# EAGLE design base-v2 (EAGLE 7.2.0)

## Sheet 1 of 2
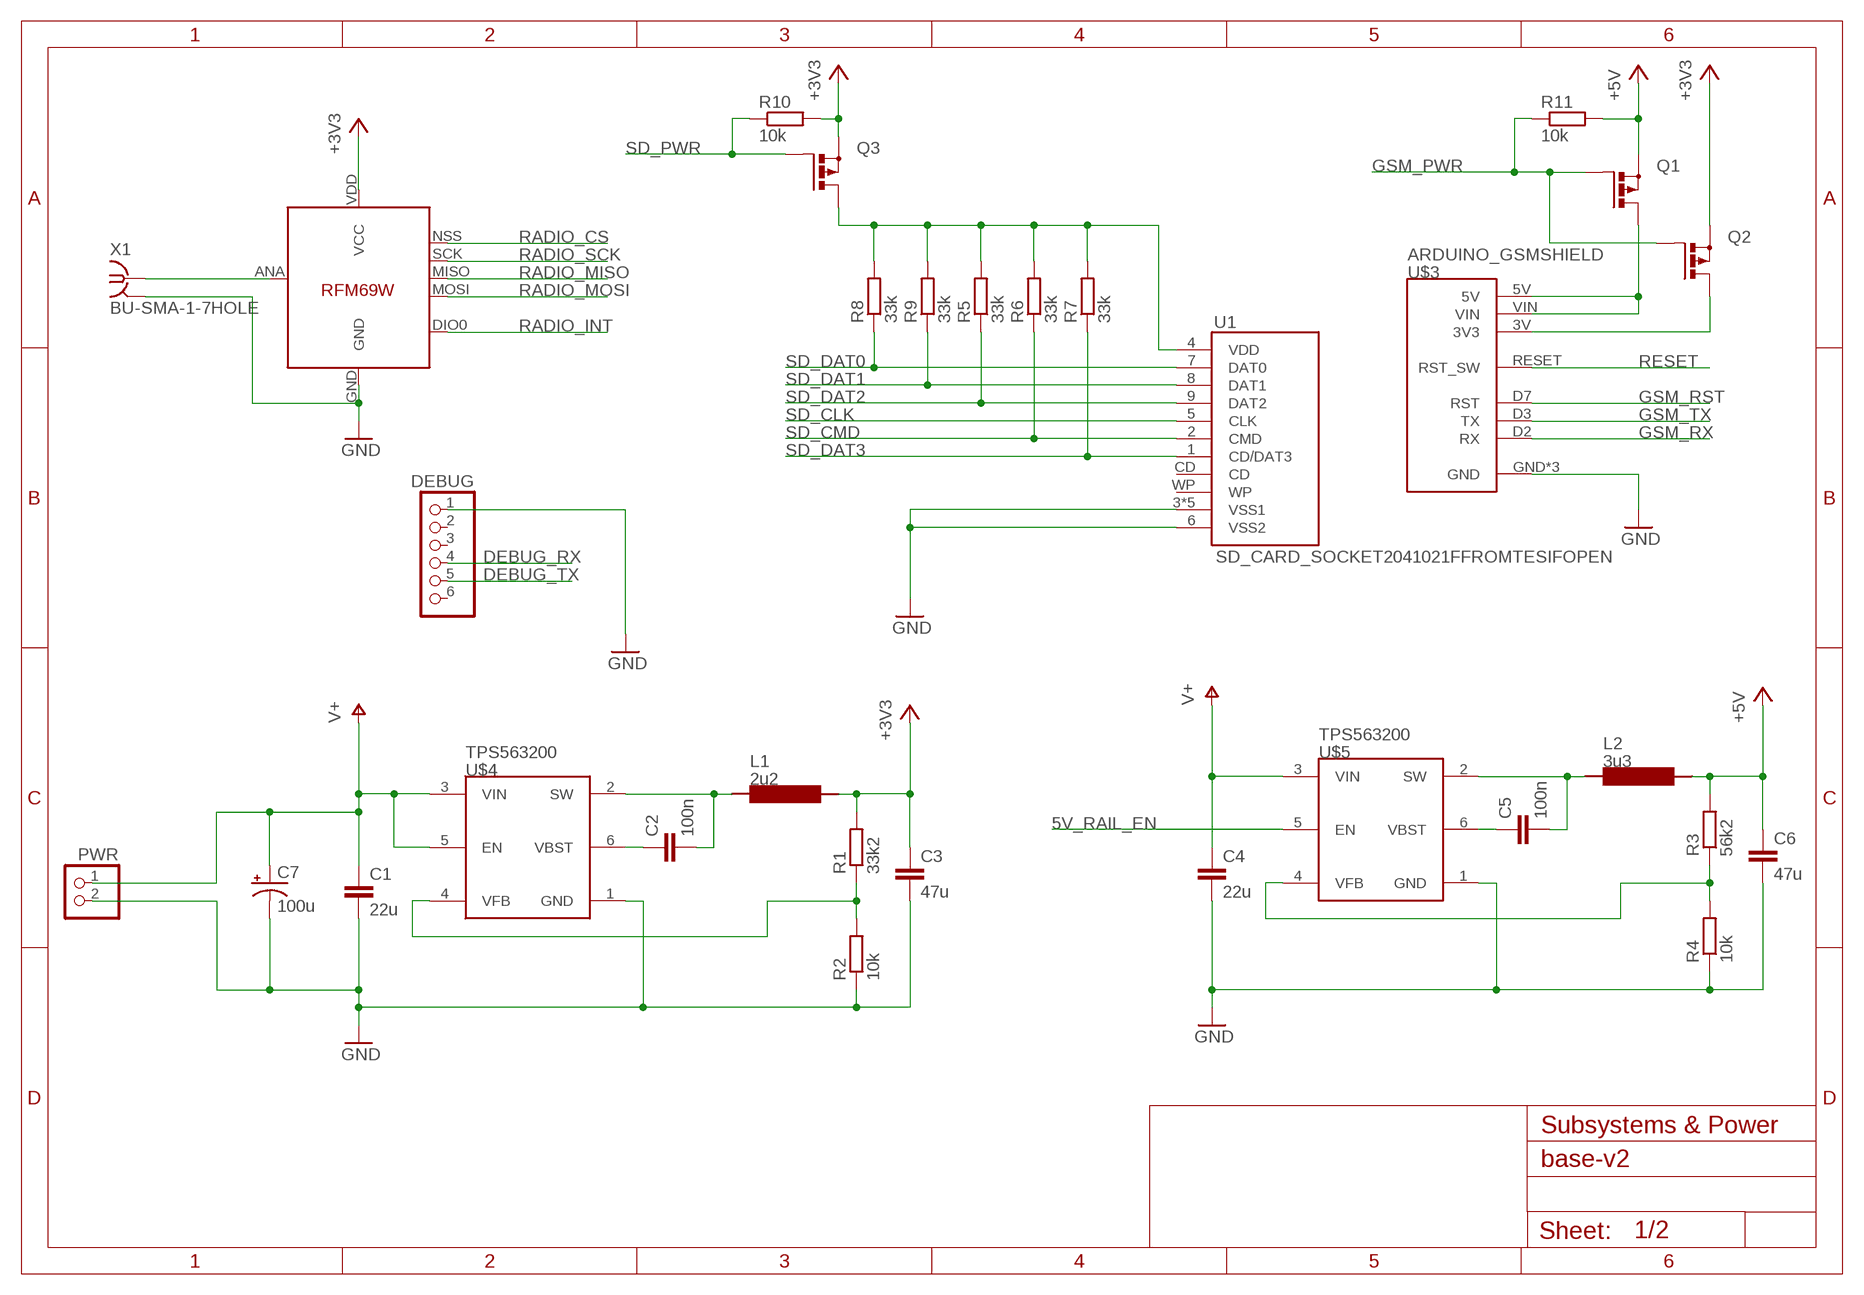
[diagram p0: schematic, sheet 1]

### Parts
C1  22u  CAP1206  [1206]
C2  100n  CAPPTH  [CAP-PTH-SMALL]
C3  47u  CAP1206  [1206]
C4  22u  CAP1206  [1206]
C5  100n  CAPPTH  [CAP-PTH-SMALL]
C6  47u  CAP1206  [1206]
C7  100u  CAP_POLPTH2  [CPOL-RADIAL-10UF-25V]
DEBUG  PINHD-1X6  [1X06]
L1  2u2  SRR7032  [SRR7032]
L2  3u3  SRR7032  [SRR7032]
PWR  PINHD-1X2  [1X02]
Q1  PMOSFET_PTO220BH  [TO220BH]
Q2  PMOSFET_PTO220BH  [TO220BH]
Q3  PMOSFET_PTO220BH  [TO220BH]
R1  33k2  R-EU_0204/7  [0204/7]
R2  10k  R-EU_0204/7  [0204/7]
R3  56k2  R-EU_0204/7  [0204/7]
R4  10k  R-EU_0204/7  [0204/7]
R5  33k  R-EU_0204/7  [0204/7]
R6  33k  R-EU_0204/7  [0204/7]
R7  33k  R-EU_0204/7  [0204/7]
R8  33k  R-EU_0204/7  [0204/7]
R9  33k  R-EU_0204/7  [0204/7]
R10  10k  R-EU_0204/7  [0204/7]
R11  10k  R-EU_0204/7  [0204/7]
U1  SD_CARD_SOCKET2041021FFROMTESIFOPEN  [SDCARD_2041021-3]
U$2  RFM69  [RFM69W-MINPADS]
U$3  ARDUINO_GSMSHIELD  [ARDUINO-NOHOLE]
U$4  TPS563200  [DDC0006A]
U$5  TPS563200  [DDC0006A]
X1  BU-SMA-1-7HOLE  [SMA_1-7HOLES]

### Nets
5V_RAIL_EN: U$5.5(EN) ; also sheet 2
+3V3: C3.1 L1.2 Q2.S Q3.S R1.2 R10.2 U$2.VDD(VCC) ; also sheet 2
+5V: C6.1 L2.2 Q1.S R3.2 R11.2 ; also sheet 2
DEBUG_RX: DEBUG.4 ; also sheet 2
DEBUG_TX: DEBUG.5 ; also sheet 2
GND: C1.2 C3.2 C4.2 C6.2 C7.2(-) DEBUG.1 PWR.2 R2.1 R4.1 U1.3(VSS1) U1.6(VSS2) U1.SH1(VSS1) U1.SH2(VSS1) U1.SH3(VSS1) U1.SH4(VSS1) U$2.GND U$3.GND U$3.GND1(GND) U$3.GND2(GND) U$4.1(GND) U$5.1(GND) X1.2 X1.3 X1.4 X1.5 ; also sheet 2
GSM_PWR: Q1.G Q2.G R11.1 ; also sheet 2
GSM_RST: U$3.D7(RST) ; also sheet 2
GSM_RX: U$3.D2(RX) ; also sheet 2
GSM_TX: U$3.D3(TX) ; also sheet 2
N$1: Q1.D U$3.5V U$3.VIN
N$2: Q2.D U$3.3V(3V3)
RADIO_ANT: U$2.ANA(ANT) X1.1
RADIO_CS: U$2.NSS(SEL) ; also sheet 2
RADIO_INT: U$2.DIO0 ; also sheet 2
RADIO_MISO: U$2.MISO ; also sheet 2
RADIO_MOSI: U$2.MOSI ; also sheet 2
RADIO_SCK: U$2.SCK ; also sheet 2
RESET: U$3.RESET(RST_SW) ; also sheet 2
SD_CLK: U1.5(CLK) ; also sheet 2
SD_CMD: R6.1 U1.2(CMD) ; also sheet 2
SD_DAT0: R8.1 U1.7(DAT0) ; also sheet 2
SD_DAT1: R9.1 U1.8(DAT1) ; also sheet 2
SD_DAT2: R5.1 U1.9(DAT2) ; also sheet 2
SD_DAT3: R7.1 U1.1(CD/DAT3) ; also sheet 2
SD_PWR: Q3.G R10.1 ; also sheet 2
SD_VCC: Q3.D R5.2 R6.2 R7.2 R8.2 R9.2 U1.4(VDD)
V+: C1.1 C4.1 C7.1(+) PWR.1 U$4.3(VIN) U$4.5(EN) U$5.3(VIN)
VREG_3_SW: C2.2 L1.1 U$4.2(SW)
VREG_3_VBST: C2.1 U$4.6(VBST)
VREG_3_VFB: R1.1 R2.2 U$4.4(VFB)
VREG_5_SW: C5.2 L2.1 U$5.2(SW)
VREG_5_VBST: C5.1 U$5.6(VBST)
VREG_5_VFB: R3.1 R4.2 U$5.4(VFB)
Unconnected: DEBUG.2 DEBUG.3 DEBUG.6 U1.CD U1.WP

### Notes on the sheet
- Subsystems & Power

## Sheet 2 of 2
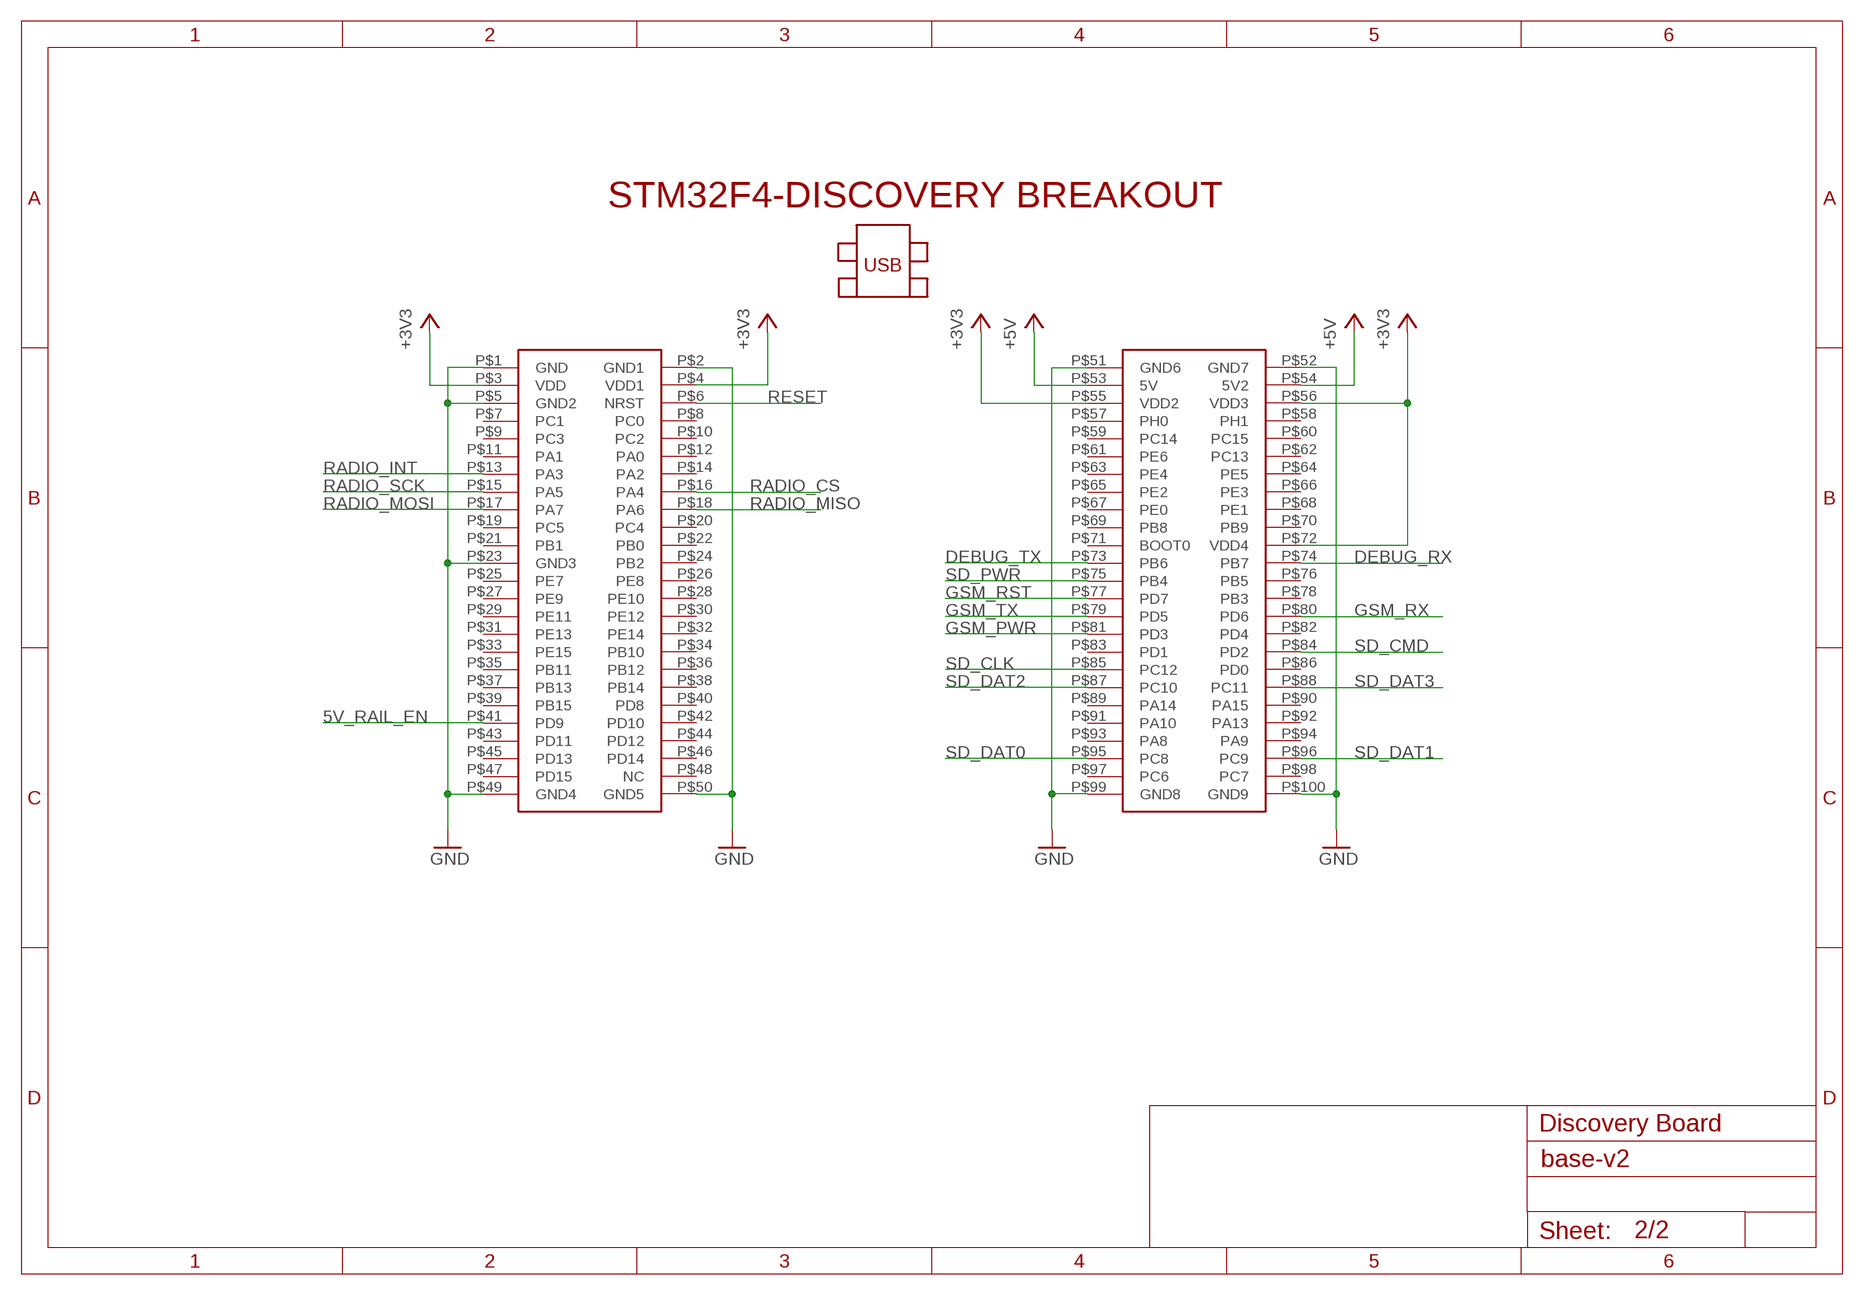
[diagram p1: schematic, sheet 2]

### Parts
U$1  STM32F4-DISCOVERY  [STM32F4-DISCOVERY]

### Nets
5V_RAIL_EN: U$1.P$41(PD9) ; also sheet 1
+3V3: U$1.P$3(VDD) U$1.P$4(VDD1) U$1.P$55(VDD2) U$1.P$56(VDD3) U$1.P$72(VDD4) ; also sheet 1
+5V: U$1.P$53(5V) U$1.P$54(5V2) ; also sheet 1
DEBUG_RX: U$1.P$74(PB7) ; also sheet 1
DEBUG_TX: U$1.P$73(PB6) ; also sheet 1
GND: U$1.P$1(GND) U$1.P$2(GND1) U$1.P$5(GND2) U$1.P$23(GND3) U$1.P$49(GND4) U$1.P$50(GND5) U$1.P$51(GND6) U$1.P$52(GND7) U$1.P$99(GND8) U$1.P$100(GND9) ; also sheet 1
GSM_PWR: U$1.P$81(PD3) ; also sheet 1
GSM_RST: U$1.P$77(PD7) ; also sheet 1
GSM_RX: U$1.P$80(PD6) ; also sheet 1
GSM_TX: U$1.P$79(PD5) ; also sheet 1
RADIO_CS: U$1.P$16(PA4) ; also sheet 1
RADIO_INT: U$1.P$13(PA3) ; also sheet 1
RADIO_MISO: U$1.P$18(PA6) ; also sheet 1
RADIO_MOSI: U$1.P$17(PA7) ; also sheet 1
RADIO_SCK: U$1.P$15(PA5) ; also sheet 1
RESET: U$1.P$6(NRST) ; also sheet 1
SD_CLK: U$1.P$85(PC12) ; also sheet 1
SD_CMD: U$1.P$84(PD2) ; also sheet 1
SD_DAT0: U$1.P$95(PC8) ; also sheet 1
SD_DAT1: U$1.P$96(PC9) ; also sheet 1
SD_DAT2: U$1.P$87(PC10) ; also sheet 1
SD_DAT3: U$1.P$88(PC11) ; also sheet 1
SD_PWR: U$1.P$75(PB4) ; also sheet 1
Unconnected: U$1.P$7(PC1) U$1.P$8(PC0) U$1.P$9(PC3) U$1.P$10(PC2) U$1.P$11(PA1) U$1.P$12(PA0) U$1.P$14(PA2) U$1.P$19(PC5) U$1.P$20(PC4) U$1.P$21(PB1) U$1.P$22(PB0) U$1.P$24(PB2) U$1.P$25(PE7) U$1.P$26(PE8) U$1.P$27(PE9) U$1.P$28(PE10) U$1.P$29(PE11) U$1.P$30(PE12) U$1.P$31(PE13) U$1.P$32(PE14) U$1.P$33(PE15) U$1.P$34(PB10) U$1.P$35(PB11) U$1.P$36(PB12) U$1.P$37(PB13) U$1.P$38(PB14) U$1.P$39(PB15) U$1.P$40(PD8) U$1.P$42(PD10) U$1.P$43(PD11) U$1.P$44(PD12) U$1.P$45(PD13) U$1.P$46(PD14) U$1.P$47(PD15) U$1.P$48(NC) U$1.P$57(PH0) U$1.P$58(PH1) U$1.P$59(PC14) U$1.P$60(PC15) U$1.P$61(PE6) U$1.P$62(PC13) U$1.P$63(PE4) U$1.P$64(PE5) U$1.P$65(PE2) U$1.P$66(PE3) U$1.P$67(PE0) U$1.P$68(PE1) U$1.P$69(PB8) U$1.P$70(PB9) U$1.P$71(BOOT0) U$1.P$76(PB5) U$1.P$78(PB3) U$1.P$82(PD4) U$1.P$83(PD1) U$1.P$86(PD0) U$1.P$89(PA14) U$1.P$90(PA15) U$1.P$91(PA10) U$1.P$92(PA13) U$1.P$93(PA8) U$1.P$94(PA9) U$1.P$97(PC6) U$1.P$98(PC7)

### Notes on the sheet
- Discovery Board

## Library data of the parts
C1-C6 = SparkFun-Capacitors:CAP: Capacitor Standard 0603 ceramic capacitor, and 0.1" leaded capacitor.
C7 = SparkFun-Passives:CAP_POL: Capacitor Polarized These are standard SMD and PTH capacitors. Normally 10uF, 47uF, and 100uF in electrolytic and tantalum varieties. Always verify the external diameter of the through hole cap, it varies with capacity, voltage, and manufacturer. The EIA devices should be standard.
DEBUG = pinhead:PINHD-1X6: PIN HEADER
L1 L2 = FullyCustom:SRR7032
PWR = pinhead:PINHD-1X2: PIN HEADER
Q1-Q3 = transistor-power:PMOSFET_P: Power MOSFET P-Channel
R1-R11 = resistor:R-EU_: RESISTOR, European symbol
U1 = FullyCustom:SD_CARD_SOCKET: SD Memory Card Connector, push-push normal type, CD enable, WP enable
U$1 = STM32F4-DISCOVERY:STM32F4-DISCOVERY
U$2 = Moteino:RFM69
U$3 = FullyCustom:ARDUINO_GSMSHIELD
U$4 U$5 = FullyCustom:TPS563200
X1 = FullyCustom:BU-SMA-1-7HOLE: FEMALE SMA CONNECTOR Radiall distributor RS 112-3794; OC_FARNELL: unknown; OC_NEWARK: unknown

## Board
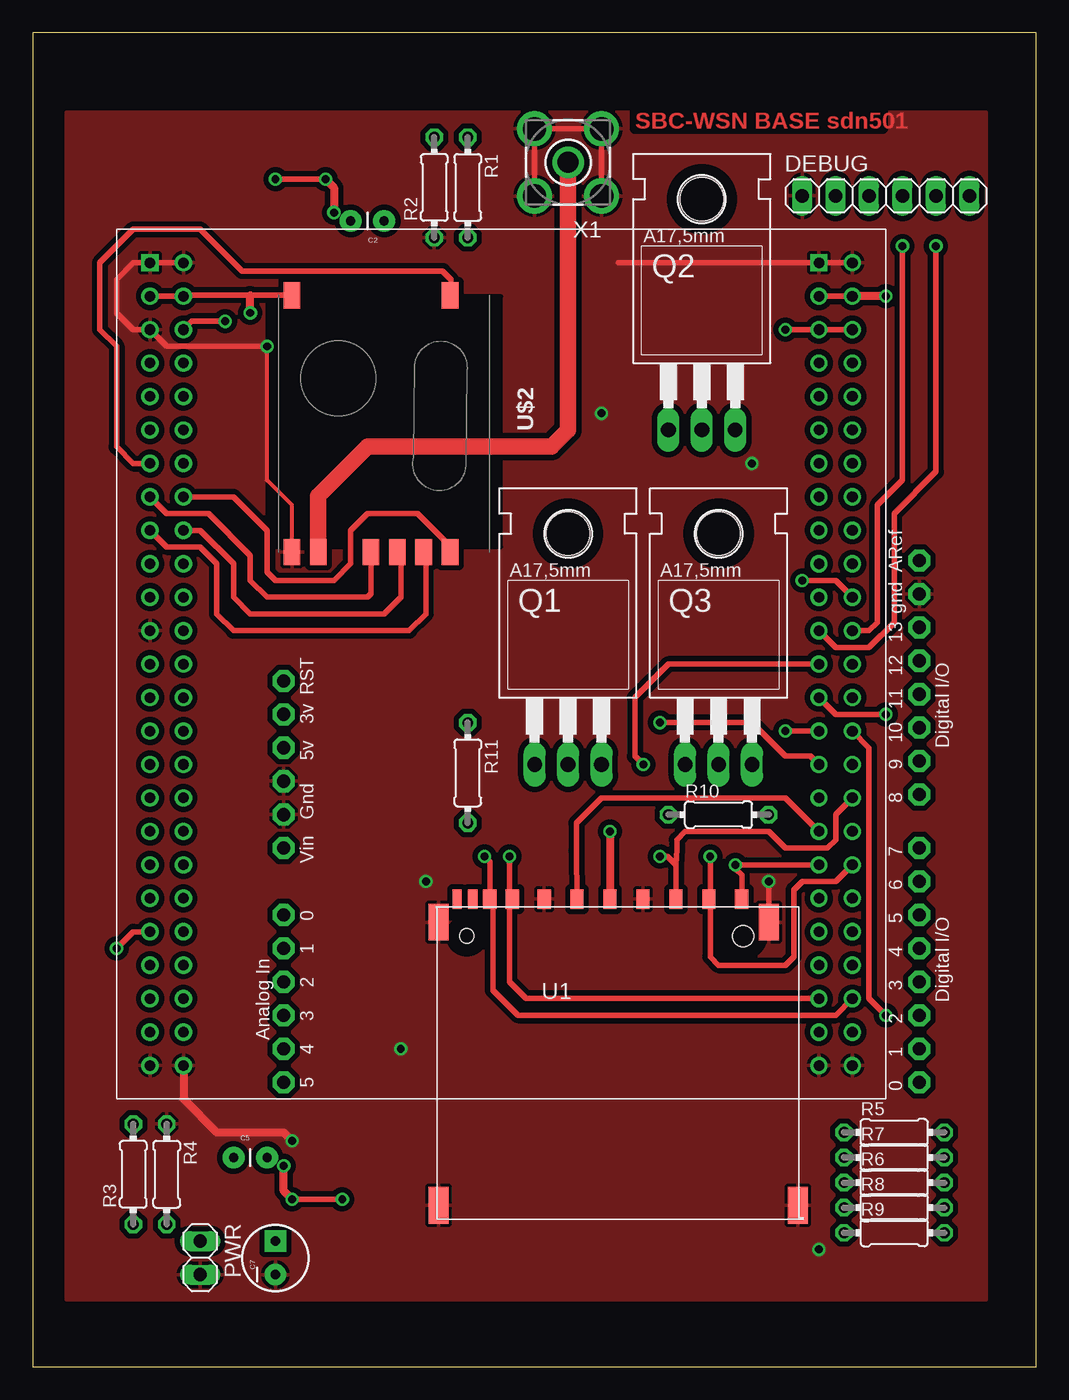
[diagram p2: board, top side]
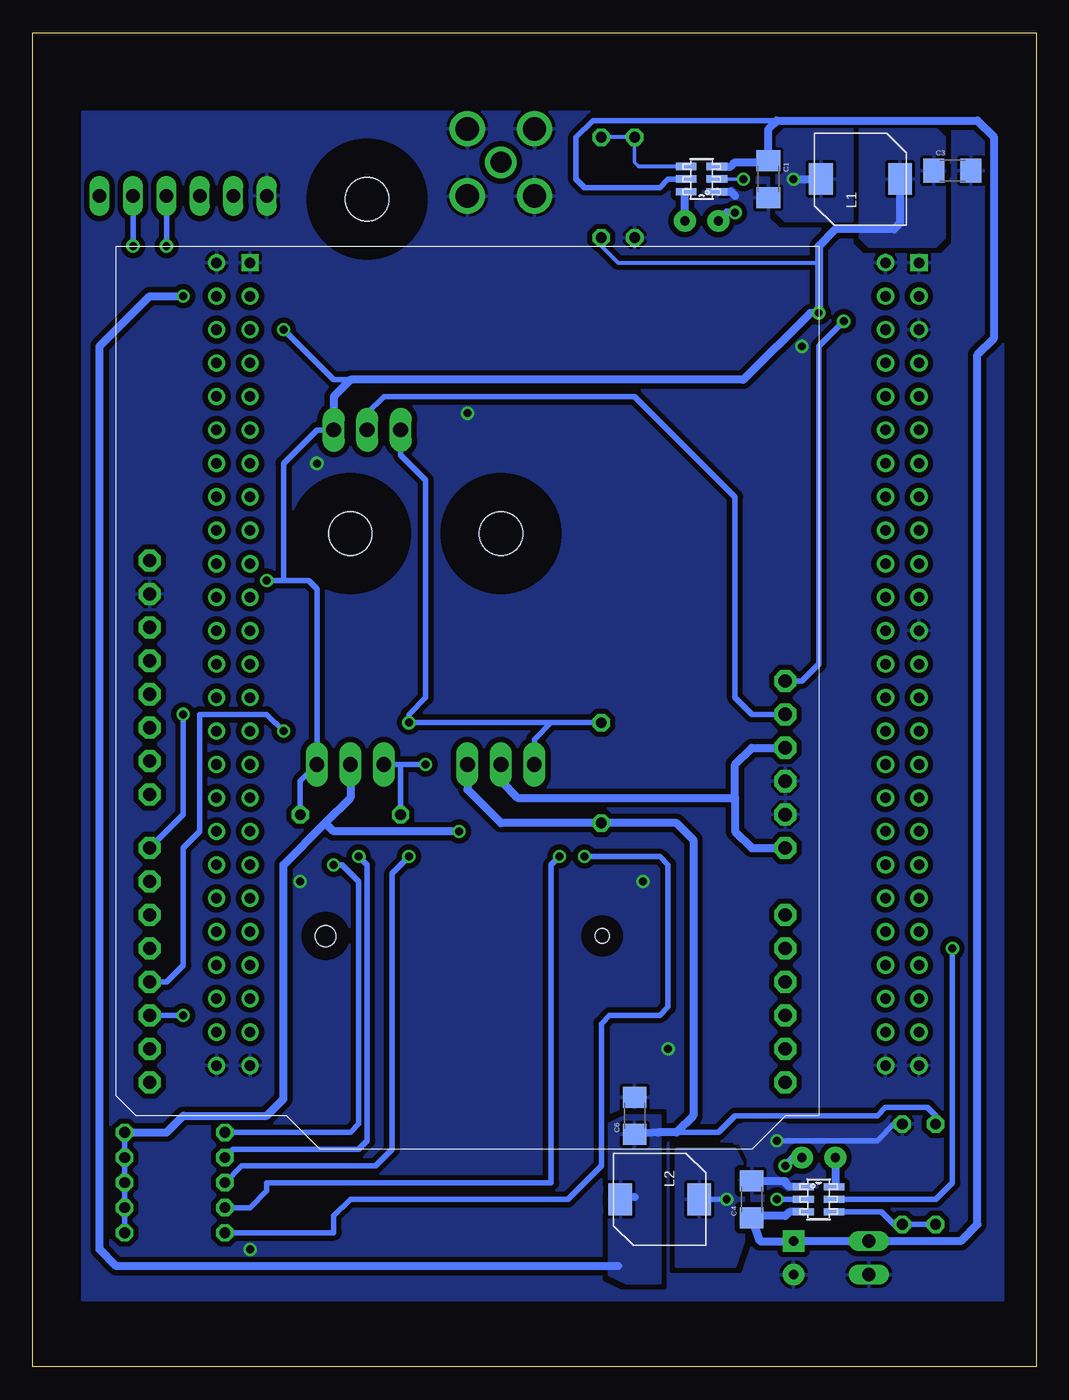
[diagram p3: board, bottom side, seen from below]

Size 76.18 x 101.27 mm. Coordinates in mm from the lower left corner, seen from the top.
Outline: 0,0 76.18,0 76.18,101.27 0,101.27 0,0
Copper layers (1*16): Top 0.035mm / dielectric 1.5mm / Bottom 0.035mm
Design rules "default *": minimum track width 10mil, minimum drill 23mil, track to track 8mil, track to pad 8mil, pad to pad 8mil, via to via 8mil, smd to smd 8mil, copper to edge 40mil, drill to drill 8mil, minimum pad ring 10mil, minimum via ring 8mil, stop-mask expansion 4mil, vias tented up to drill 0mil, thermal gap 10mil

### Footprints (pad centres in the part's own frame; a part is rotated, then mirrored left to right if it is on the bottom)
1206 = smd 1.6 x 1.8: 1 -1.4,0; 2 1.4,0
CAP-PTH-SMALL = drill 0.7 pad 1.651: 1 0,0; 2 2.54,0
CPOL-RADIAL-10UF-25V = drill 0.7 pad 1.651 square: 1 1.27,0 | drill 0.7 pad 1.651: 2 -1.27,0
1X06 = drill 1.016 long: 1 -6.35,0; 2 -3.81,0; 3 -1.27,0; 4 1.27,0; 5 3.81,0; 6 6.35,0
SRR7032 = smd 2.4 x 1.8: 1 0,3; 2 0,-3
1X02 = drill 1.016 long: 1 -1.27,0; 2 1.27,0
TO220BH = drill 1.118 long: D 0,-6.35; G -2.54,-6.35; S 2.54,-6.35 | hole 3.302: 0,11.176
0204/7 = drill 0.813 octagon: 1 -3.81,0; 2 3.81,0
SDCARD_2041021-3 = smd 1 x 1.5: 1 6.875,24.7; 2 4.375,24.7; 3 1.875,24.7; 4 -0.625,24.7; 5 -3.125,24.7; 6 -5.625,24.7; 7 -8.05,24.7; 8 -9.75,24.7; 9 9.375,24.7 | smd 0.7 x 1.5: CD -11.05,24.7; WP -12.25,24.7 | smd 1.5 x 2.8: SH1 -13.65,22.95; SH2 11.45,22.95; SH3 -13.65,1.45; SH4 13.65,1.45 | hole 1.1: -11.5,21.9 | hole 1.6: 9.5,21.9
STM32F4-DISCOVERY = drill 0.8 square: P$1 -27.94,30.48; P$51 22.86,30.48 | drill 0.8: P$2 -25.4,30.48; P$3 -27.94,27.94; P$4 -25.4,27.94; P$5 -27.94,25.4; P$6 -25.4,25.4; P$7 -27.94,22.86; P$8 -25.4,22.86; P$9 -27.94,20.32; P$10 -25.4,20.32; P$11 -27.94,17.78; P$12 -25.4,17.78; P$13 -27.94,15.24; P$14 -25.4,15.24; P$15 -27.94,12.7; P$16 -25.4,12.7; P$17 -27.94,10.16; P$18 -25.4,10.16; P$19 -27.94,7.62; P$20 -25.4,7.62; P$21 -27.94,5.08; P$22 -25.4,5.08; P$23 -27.94,2.54; P$24 -25.4,2.54; P$25 -27.94,0; P$26 -25.4,0; P$27 -27.94,-2.54; P$28 -25.4,-2.54; P$29 -27.94,-5.08; P$30 -25.4,-5.08; P$31 -27.94,-7.62; P$32 -25.4,-7.62; P$33 -27.94,-10.16; P$34 -25.4,-10.16; P$35 -27.94,-12.7; P$36 -25.4,-12.7; P$37 -27.94,-15.24; P$38 -25.4,-15.24; P$39 -27.94,-17.78; P$40 -25.4,-17.78; P$41 -27.94,-20.32; P$42 -25.4,-20.32; P$43 -27.94,-22.86; P$44 -25.4,-22.86; P$45 -27.94,-25.4; P$46 -25.4,-25.4; P$47 -27.94,-27.94; P$48 -25.4,-27.94; P$49 -27.94,-30.48; P$50 -25.4,-30.48; P$52 25.4,30.48; P$53 22.86,27.94; P$54 25.4,27.94; P$55 22.86,25.4; P$56 25.4,25.4; P$57 22.86,22.86; P$58 25.4,22.86; P$59 22.86,20.32; P$60 25.4,20.32; P$61 22.86,17.78; P$62 25.4,17.78; P$63 22.86,15.24; P$64 25.4,15.24; P$65 22.86,12.7; P$66 25.4,12.7; P$67 22.86,10.16; P$68 25.4,10.16; P$69 22.86,7.62; P$70 25.4,7.62; P$71 22.86,5.08; P$72 25.4,5.08; P$73 22.86,2.54; P$74 25.4,2.54; P$75 22.86,0; P$76 25.4,0; P$77 22.86,-2.54; P$78 25.4,-2.54; P$79 22.86,-5.08; P$80 25.4,-5.08; P$81 22.86,-7.62; P$82 25.4,-7.62; P$83 22.86,-10.16; P$84 25.4,-10.16; P$85 22.86,-12.7; P$86 25.4,-12.7; P$87 22.86,-15.24; P$88 25.4,-15.24; P$89 22.86,-17.78; P$90 25.4,-17.78; P$91 22.86,-20.32; P$92 25.4,-20.32; P$93 22.86,-22.86; P$94 25.4,-22.86; P$95 22.86,-25.4; P$96 25.4,-25.4; P$97 22.86,-27.94; P$98 25.4,-27.94; P$99 22.86,-30.48; P$100 25.4,-30.48
RFM69W-MINPADS = smd 2 x 1.27: ANA 8,-5; DIO0 -11.5,5; GND 8,-7; MISO 8,1; MOSI 8,3; NSS 8,5; SCK 8,-1; VDD -11.5,-7
ARDUINO-NOHOLE = drill 1 pad 1.676 octagon: 3V 35.56,2.54; 5V 38.1,2.54; A0 50.8,2.54; A1 53.34,2.54; A2 55.88,2.54; A3 58.42,2.54; A4 60.96,2.54; A5 63.5,2.54; AREF 23.876,50.8; D0 63.5,50.8; D1 60.96,50.8; D2 58.42,50.8; D3 55.88,50.8; D4 53.34,50.8; D5 50.8,50.8; D6 48.26,50.8; D7 45.72,50.8; D8 41.656,50.8; D9 39.116,50.8; D10 36.576,50.8; D11 34.036,50.8; D12 31.496,50.8; D13 28.956,50.8; GND 26.416,50.8; GND1 43.18,2.54; GND2 40.64,2.54; RESET 33.02,2.54; VIN 45.72,2.54
DDC0006A = smd 1.575 x 0.559: 1 -1.168,0.95; 2 -1.168,0; 3 -1.168,-0.95; 4 1.168,-0.95; 5 1.168,0; 6 1.168,0.95
SMA_1-7HOLES = drill 1.6: 1 0,0 | drill 1.778: 2 -2.55,2.55; 3 2.55,2.55; 4 2.55,-2.55; 5 -2.55,-2.55

### Placement (x,y rotation side)
C1  20.32,90.17 270 bottom
C2  26.67,87 180 top
C3  6.35,90.81 0 bottom
C4  21.59,12.7 90 bottom
C5  15.24,15.88 0 top
C6  30.48,19.05 90 bottom
C7  18.41,8.26 90 top
DEBUG  64.77,88.9 0 top
L1  13.34,90.17 90 bottom
L2  28.57,12.7 270 bottom
PWR  12.7,8.26 270 top
Q1  40.64,52.07 0 top
Q2  50.8,77.47 0 top
Q3  52.07,52.07 0 top
R1  33.02,89.53 270 top
R2  30.48,89.53 90 top
R3  7.62,14.61 90 top
R4  10.16,14.61 270 top
R5  65.41,17.78 0 top
R6  65.41,13.97 0 top
R7  65.41,15.88 0 top
R8  65.41,12.06 0 top
R9  65.41,10.16 0 top
R10  52.07,41.91 0 top
R11  33.02,45.09 270 top
U1  44.45,10.79 0 top
U$1  36.83,53.34 0 top
U$2  26.67,69.85 270 top
U$3  16.51,85.09 270 top
U$4  25.4,90.17 180 bottom
U$5  16.51,12.7 0 bottom
X1  40.64,91.44 180 top

### Tracks (layer width: path | path; a pad name or v marks a point on that pad's centre or on a via)
5V_RAIL_EN  (via drill 0.6)
  Top 0.406: v6.35,31.75 7.62,33.02 U$1.P$41
  Bottom 0.406: U$5.5 7.62,12.7 6.35,13.97 v6.35,31.75
+3V3  (via drill 0.6)
  Top 0.406: U$1.P$3 U$1.P$4 11.43,81.35 16.51,81.35 U$2.VDD | U$1.P$56 U$1.P$55 v57.15,78.74 | U$1.P$72 60.96,59.69 v58.42,59.69
  Top 0.61: v16.51,80.01 16.51,81.35
  Bottom 0.305: R1.2 33.02,85.09 31.75,83.82 16.51,83.82
  Bottom 0.406: Q2.S 54.61,71.12 57.15,68.58 57.15,59.69 | 52.07,74.93 53.34,74.93 v57.15,78.74 | 57.15,59.69 55.24,59.69 54.61,59.05 Q3.S 55.88,44.45 R10.2 | 57.15,59.69 v58.42,59.69
  Bottom 0.61: Q2.S 53.34,73.66 52.07,74.93 22.23,74.93 17.14,80.01 v16.51,80.01 16.51,83.82 16.51,85.09 15.24,86.36 10.79,86.36 10.34,86.82 L1.2
  pour Bottom: 7.62,93.98 13.34,93.98 13.34,85.72 12.7,85.09 7.62,85.09 6.99,85.72 6.99,93.34
+5V  (via drill 0.6)
  Top 0.406: U$1.P$53 U$1.P$54
  Top 0.61: v64.77,81.28 U$1.P$54
  Bottom 0.406: R3.2 7.62,19.05 8.26,19.68 11.43,19.68 12.06,19.05 22.86,19.05 24.13,17.78 29.21,17.78 C6.1
  Bottom 0.61: v64.77,81.28 67.31,81.28 71.12,77.47 71.12,8.89 69.85,7.62 31.75,7.62 | Q1.S 43.18,43.81 40.64,41.27 R11.2 27.3,41.27 26.04,40.01 26.04,19.05 27.3,17.78 28.7,17.78 C6.1 | 30.48,12.88 L2.2
  pour Bottom: 28.57,6.35 28.57,19.05 31.11,19.05 32.38,18.41 32.38,6.99 31.11,6.35
DEBUG_RX  (via drill 0.6)
  Top 0.406: U$1.P$74 63.5,55.88 64.14,56.52 64.14,65.41 66.04,67.31 v66.04,85.09
  Bottom 0.406: DEBUG.4 v66.04,85.09
DEBUG_TX  (via drill 0.6)
  Top 0.406: U$1.P$73 60.96,54.61 63.5,54.61 65.41,56.52 65.41,64.77 68.58,67.94 v68.58,85.09
  Bottom 0.406: v68.58,85.09 DEBUG.5
GND  (via drill 0.6)
  Top 0.305: U$2.GND 19.67,65.42 17.78,67.31 v17.78,77.47
  Top 0.406: U$1.P$2 U$1.P$1 7.62,83.82 6.35,82.55 6.35,80.01 7.62,78.74 U$1.P$5 10.16,77.47 v17.78,77.47 | X1.3 X1.4 X1.5 X1.2 | 44.45,83.82 U$1.P$51 U$1.P$52 | U1.SH2 55.9,36.81 v55.88,36.83
  Top 0.61: U$1.P$50 11.43,20.32 13.97,17.78 19.05,17.78 v19.68,17.14
  Bottom 0.305: 30.48,85.09 R2.1
  Bottom 0.406: v19.68,17.14 12.06,17.14 10.79,18.41 R4.1
  Bottom 0.61: U$4.1 23.18,89.22 22.86,88.9 | U$5.1 18.73,13.65 19.05,13.97 19.05,14.1 C4.2
  other vias: 59.69,8.89 43.18,72.39 29.84,36.83 27.94,24.13 54.61,68.58
  pour Bottom (isolate 0.254, rank 2): 20.32,13.97 20.32,16.51 18.41,17.14 19.05,18.41 22.23,18.41 22.86,17.14 22.86,14.61 22.23,13.97
  pour Top (isolate 0.406): 2.54,95.25 2.54,5.08 72.39,5.08 72.39,95.25
  pour Bottom (isolate 0.406, rank 3): 72.39,95.25 2.54,95.25 2.54,5.08 72.39,5.08
GSM_PWR  (via drill 0.6)
  Top 0.406: U$1.P$81 59.05,46.35 57.15,46.35 54.61,48.9 v47.62,48.9
  Bottom 0.406: Q1.G 38.1,47.62 36.83,48.9 | Q2.G 48.26,69.22 46.35,67.31 46.35,50.8 47.62,49.53 v47.62,48.9 36.83,48.9 | R11.1 36.83,48.9
GSM_RST  (via drill 0.6)
  Top 0.406: U$1.P$77 60.96,49.53 v64.77,49.53
  Bottom 0.406: v64.77,49.53 64.77,41.91 U$3.D7
GSM_RX  (via drill 0.6)
  Top 0.406: U$1.P$80 63.5,46.99 63.5,27.94 v64.77,26.67
  Bottom 0.406: v64.77,26.67 U$3.D2
GSM_TX  (via drill 0.6)
  Top 0.406: v57.15,48.26 U$1.P$79
  Bottom 0.406: U$3.D3 66.04,29.21 64.77,30.48 64.77,39.37 63.5,40.64 63.5,49.53 58.42,49.53 v57.15,48.26
N$1
  Bottom 0.61: Q1.D 40.64,44.45 39.37,43.18 22.86,43.18 | 22.86,43.18 22.86,40.64 21.59,39.37 U$3.VIN | 22.86,43.18 22.86,45.72 21.59,46.99 U$3.5V
N$2
  Bottom 0.406: U$3.3V 21.59,49.53 22.86,50.8 22.86,66.04 30.48,73.66 49.53,73.66 50.8,72.39 Q2.D
N$3
  cutout Top: 17.78,81.28 17.78,62.23 35.56,62.23 35.56,81.28
RADIO_ANT
  Top 1.27: U$2.ANA 21.67,66.12 25.4,69.85 39.37,69.85 40.64,71.12 X1.1
RADIO_CS
  Top 0.406: U$2.NSS 31.67,62.31 29.21,64.77 25.4,64.77 24.13,63.5 24.13,60.96 22.86,59.69 18.41,59.69 17.78,60.33 17.78,63.5 15.24,66.04 U$1.P$16
RADIO_INT
  Top 0.406: U$1.P$13 7.62,68.58 6.35,69.85 6.35,77.47 5.08,78.74 5.08,83.82 7.62,86.36 12.7,86.36 15.88,83.19 31.11,83.19 31.75,82.55 31.75,81.43 U$2.DIO0
RADIO_MISO
  Top 0.406: U$1.P$18 12.7,63.5 15.24,60.96 15.24,58.42 16.51,57.15 26.67,57.15 27.94,58.42 27.94,61.58 U$2.MISO
RADIO_MOSI
  Top 0.406: U$1.P$17 10.16,62.23 12.7,62.23 13.97,60.96 13.97,57.15 15.24,55.88 28.57,55.88 29.84,57.15 29.84,61.67 U$2.MOSI
RADIO_SCK
  Top 0.406: U$2.SCK 25.67,58.69 25.4,58.42 17.78,58.42 16.51,59.69 16.51,61.59 13.34,64.77 10.16,64.77 U$1.P$15
RESET  (via drill 0.6)
  Top 0.406: v14.61,79.38 12.06,79.38 U$1.P$6
  Bottom 0.406: U$3.RESET 17.78,52.07 16.51,53.34 16.51,77.47 v14.61,79.38
SD_CLK
  Top 0.406: U$1.P$85 57.15,43.18 43.18,43.18 41.27,41.27 41.27,39.16 U1.5
SD_CMD  (via drill 0.6)
  Top 0.406: U$1.P$84 60.96,41.91 60.96,40.01 60.33,39.37 57.15,39.37 55.88,40.64 49.53,40.64 48.9,40.01 48.9,39.27 48.84,38.07 | 48.84,38.07 U1.2 | v47.62,38.73 48.18,38.73 48.84,38.07
  Bottom 0.406: v47.62,38.73 48.9,37.47 48.9,16.51 50.16,15.24 60.33,15.24 R6.1
SD_DAT0  (via drill 0.6)
  Top 0.406: U$1.P$95 37.47,27.94 36.2,29.21 36.2,35.29 U1.7 36.2,35.4 v36.2,38.73
  Bottom 0.406: v36.2,38.73 36.83,38.1 36.83,13.97 58.42,13.97 58.42,13.34 59.69,12.06 R8.1
SD_DAT1  (via drill 0.6)
  Top 0.406: U$1.P$96 60.96,26.67 36.83,26.67 34.92,28.57 34.92,35.27 U1.8 34.7,38.33 v34.29,38.73
  Bottom 0.406: R9.1 53.34,10.16 53.34,11.43 52.07,12.7 35.56,12.7 33.02,15.24 33.02,26.04 32.38,26.67 28.57,26.67 27.94,27.3 27.94,38.1 28.57,38.73 v34.29,38.73
SD_DAT2  (via drill 0.6)
  Top 0.406: U$1.P$87 v53.34,38.1 53.34,37.8 53.83,37.31 U1.9
  Bottom 0.406: R5.1 52.07,17.78 51.44,18.41 51.44,36.83 52.7,38.1 v53.34,38.1
SD_DAT3  (via drill 0.6)
  Top 0.406: v51.44,38.73 51.44,35.51 U1.1 51.44,35.08 51.44,31.11 52.07,30.48 57.15,30.48 57.78,31.11 57.78,36.2 58.42,36.83 60.96,36.83 U$1.P$88
  Bottom 0.406: v51.44,38.73 50.8,38.1 50.8,17.14 51.44,16.51 60.96,16.51 R7.1
SD_PWR  (via drill 0.6)
  Top 0.406: U$1.P$75 48.26,53.34 45.72,50.8 45.72,46.35 v46.35,45.72
  Bottom 0.406: 48.26,45.72 Q3.G | R10.1 48.26,45.72 | v46.35,45.72 48.26,45.72
SD_VCC  (via drill 0.6)
  Top 0.61: v43.81,40.64 43.81,35.38 U1.4
  Bottom 0.406: R9.2 R8.2 R6.2 R7.2 R5.2
  Bottom 0.61: Q3.D 52.07,43.18 53.98,41.27 | R5.2 66.04,17.78 64.77,19.05 58.42,19.05 57.15,20.32 57.15,38.1 53.98,41.27 | v43.81,40.64 53.34,40.64 53.98,41.27
V+
  Bottom 0.406: U$4.5 27.94,90.17 28.57,89.53 34.29,89.53 34.92,90.17 34.92,93.34 33.66,94.61 19.68,94.61
  Bottom 0.61: U$4.3 23.18,91.12 22.86,91.44 21.09,91.44 C1.1 20.32,93.98 19.68,94.61 4.45,94.61 3.17,93.34 3.17,78.11 4.45,76.83 4.45,10.79 5.71,9.53 PWR.1 C7.1 20.95,9.53 C4.1 20.95,11.43 19.05,11.43 18.73,11.75 U$5.3
VREG_3_SW  (via drill 0.6)
  Top 0.406: v22.23,90.17 v18.41,90.17
  Top 0.61: v22.23,90.17 22.86,89.53 v22.86,87.63
  Bottom 0.254: U$4.2 v22.23,90.17
  Bottom 0.61: v22.86,87.63 23.5,87.63 C2.2 | v18.41,90.17 L1.1
  pour Bottom: 13.97,93.98 19.05,93.98 19.68,93.34 19.68,87.63 19.05,87 13.97,87
VREG_3_VBST
  Bottom 0.61: C2.1 26.67,89.12 U$4.6
VREG_3_VFB
  Bottom 0.254: 30.16,91.12 30.48,91.44 R2.2
  Bottom 0.305: U$4.4 30.16,91.12 | R2.2 R1.1
VREG_5_SW  (via drill 0.6)
  Top 0.406: v23.5,12.7 v19.68,12.7
  Top 0.61: v19.68,12.7 19.05,13.34 v19.05,15.24
  Bottom 0.406: v19.68,12.7 U$5.2 | v23.5,12.7 L2.1
  Bottom 0.61: C5.2 18.41,15.88 v19.05,15.24
  pour Bottom (isolate 0.406): 22.23,15.24 22.23,9.53 22.86,7.62 27.3,7.62 27.3,16.51 22.86,16.51
VREG_5_VBST
  Bottom 0.61: C5.1 15.24,13.75 U$5.6
VREG_5_VFB
  Bottom 0.406: U$5.4 11.75,11.75 10.79,10.79 R4.2 R3.1

### Text on the board
Top: SBC-WSN BASE sdn501